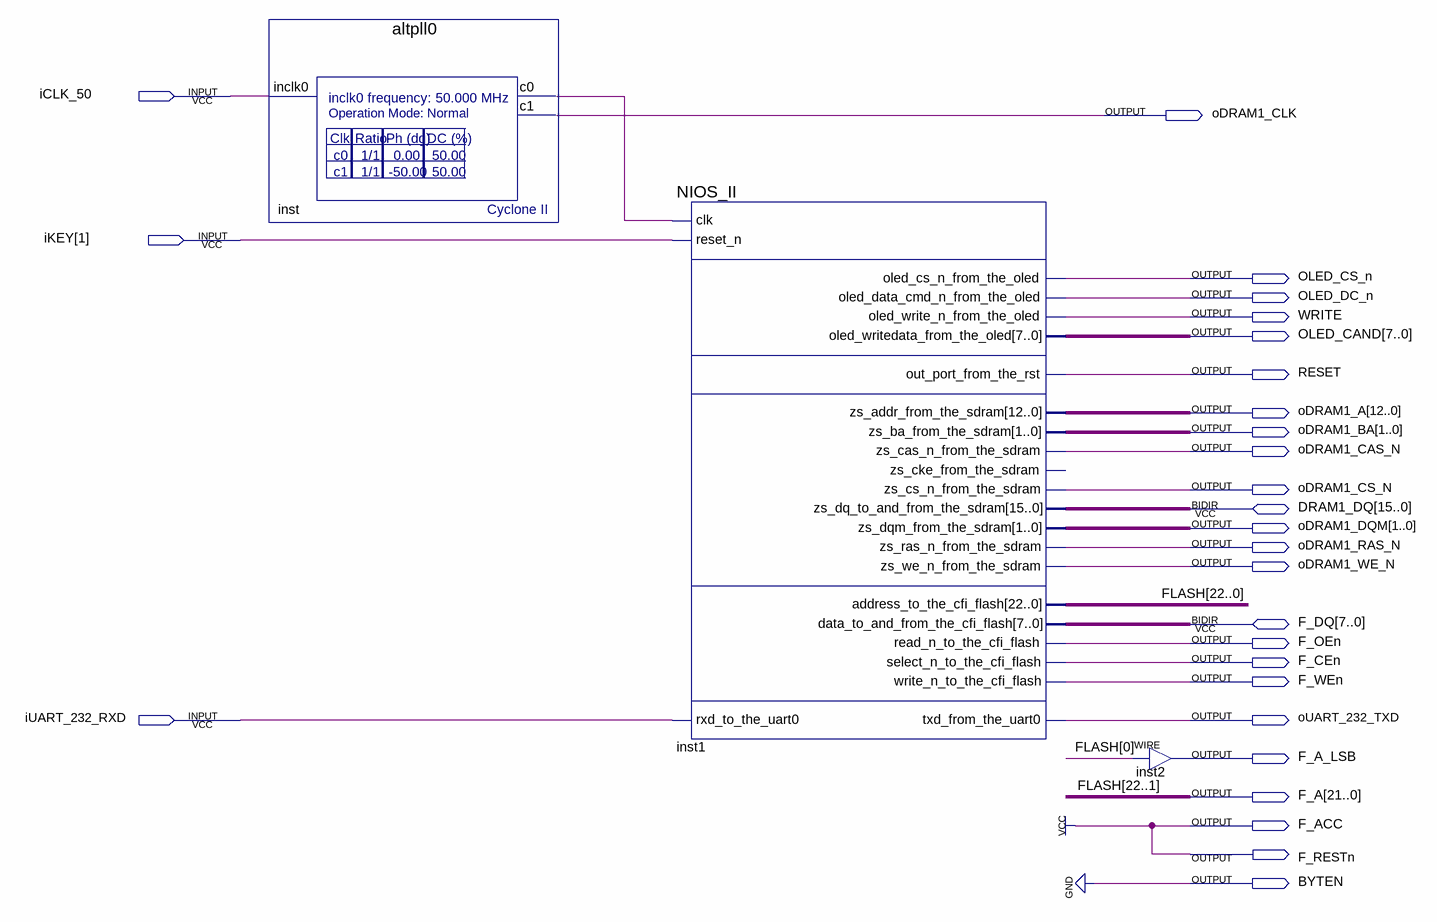
[diagram p0: schematic sheet]
// Quartus schematic TOP.bdf as structural Verilog: 3 symbols, 27 pins
module TOP (
  input  iCLK_50,
  input  [1:1] iKEY,
  input  iUART_232_RXD,
  inout  [15:0] DRAM1_DQ,
  inout  [7:0] F_DQ,
  output oDRAM1_CLK,
  output OLED_CS_n,
  output OLED_DC_n,
  output WRITE,
  output [7:0] OLED_CAND,
  output RESET,
  output [12:0] oDRAM1_A,
  output [1:0] oDRAM1_BA,
  output oDRAM1_CAS_N,
  output oDRAM1_CS_N,
  output [1:0] oDRAM1_DQM,
  output oDRAM1_RAS_N,
  output oDRAM1_WE_N,
  output F_OEn,
  output F_CEn,
  output F_WEn,
  output oUART_232_TXD,
  output F_A_LSB,
  output [21:0] F_A,
  output F_ACC,
  output F_RESTn,
  output BYTEN
);

  wire inst_c0;
  wire [0:0] FLASH;

  altpll0 inst (.inclk0(iCLK_50), .c0(inst_c0), .c1(oDRAM1_CLK));
  NIOS_II inst1 (
    .clk(inst_c0), .reset_n(iKEY[1]), .rxd_to_the_uart0(iUART_232_RXD), .oled_cs_n_from_the_oled(OLED_CS_n),
    .oled_data_cmd_n_from_the_oled(OLED_DC_n), .oled_write_n_from_the_oled(WRITE),
    .oled_writedata_from_the_oled(OLED_CAND), .out_port_from_the_rst(RESET),
    .zs_addr_from_the_sdram(oDRAM1_A), .zs_ba_from_the_sdram(oDRAM1_BA),
    .zs_cas_n_from_the_sdram(oDRAM1_CAS_N), .zs_cs_n_from_the_sdram(oDRAM1_CS_N),
    .zs_dqm_from_the_sdram(oDRAM1_DQM), .zs_ras_n_from_the_sdram(oDRAM1_RAS_N),
    .zs_we_n_from_the_sdram(oDRAM1_WE_N), .address_to_the_cfi_flash({F_A, FLASH[0]}),
    .read_n_to_the_cfi_flash(F_OEn), .select_n_to_the_cfi_flash(F_CEn), .write_n_to_the_cfi_flash(F_WEn),
    .txd_from_the_uart0(oUART_232_TXD), .zs_dq_to_and_from_the_sdram(DRAM1_DQ),
    .data_to_and_from_the_cfi_flash(F_DQ));  // open: zs_cke_from_the_sdram
  assign F_A_LSB = FLASH[0];  // WIRE inst2

  assign BYTEN = 1'b0;
  assign F_ACC = 1'b1;
  assign F_RESTn = 1'b1;

  // Other names for the same wires on the sheet: FLASH[22:1] = F_A
endmodule
